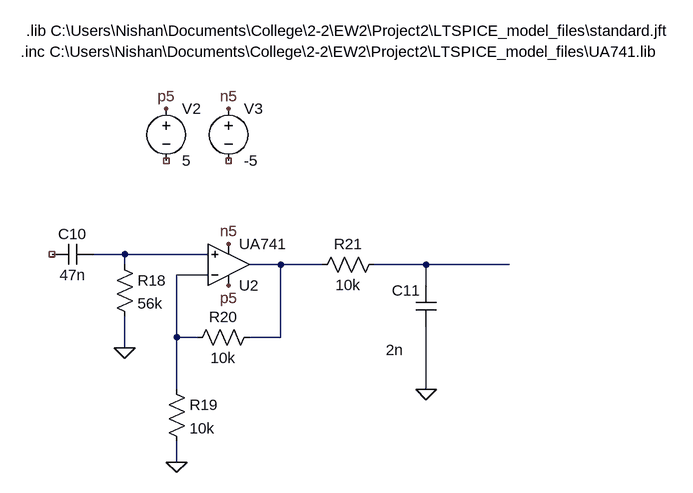
[diagram p0: schematic BPF.asc]
BPF.asc, the LTspice schematic file:
Version 4.1
SHEET 1 4496 2220
WIRE -48 384 -96 384
WIRE 80 384 -48 384
WIRE -48 400 -48 384
WIRE 192 400 144 400
WIRE 256 400 192 400
WIRE 416 400 336 400
WIRE 544 400 416 400
WIRE 80 416 32 416
WIRE 416 432 416 400
WIRE 32 512 32 416
WIRE 64 512 32 512
WIRE 192 512 192 400
WIRE 192 512 144 512
WIRE -48 528 -48 480
WIRE 32 592 32 512
WIRE 416 592 416 496
WIRE 32 704 32 672
FLAG 16 160 p5
FLAG 112 160 n5
FLAG -48 528 0
FLAG 112 368 n5
FLAG 112 432 p5
FLAG 32 704 0
FLAG 416 592 0
SYMBOL voltage 16 144 R0
WINDOW 123 0 0 Left 0
WINDOW 39 0 0 Left 0
SYMATTR InstName V2
SYMATTR Value 5
SYMBOL voltage 112 144 R0
WINDOW 123 0 0 Left 0
WINDOW 39 0 0 Left 0
SYMATTR InstName V3
SYMATTR Value -5
SYMBOL OpAmps\\opamp2 112 464 M180
SYMATTR InstName U2
SYMATTR Value UA741
SYMBOL cap -96 368 R90
WINDOW 0 0 32 VBottom 2
WINDOW 3 32 32 VTop 2
SYMATTR InstName C10
SYMATTR Value 47n
SYMBOL res -64 384 R0
SYMATTR InstName R18
SYMATTR Value 56k
SYMBOL res 16 576 R0
SYMATTR InstName R19
SYMATTR Value 10k
SYMBOL res 160 496 R90
WINDOW 0 0 56 VBottom 2
WINDOW 3 32 56 VTop 2
SYMATTR InstName R20
SYMATTR Value 10k
SYMBOL res 352 384 R90
WINDOW 0 0 56 VBottom 2
WINDOW 3 32 56 VTop 2
SYMATTR InstName R21
SYMATTR Value 10k
SYMBOL cap 432 496 R180
WINDOW 0 24 56 Left 2
WINDOW 3 51 -35 Left 2
SYMATTR InstName C11
SYMATTR Value 2n
TEXT -200 40 Left 2 !.lib C:\\Users\\Nishan\\Documents\\College\\2-2\\EW2\\Project2\\LTSPICE_model_files\\standard.jft
TEXT -208 72 Left 2 !.inc C:\\Users\\Nishan\\Documents\\College\\2-2\\EW2\\Project2\\LTSPICE_model_files\\UA741.lib

The netlist it stands for:
* BPF.asc
V2 p5 NC_01 5
V3 n5 NC_02 -5
X§U2 N001 N004 p5 n5 N002 UA741  ; pins In+ In- V+ V- OUT
C10 N001 NC_03 47n
R18 N001 0 56k
R19 N004 0 10k
R20 N002 N004 10k
R21 N003 N002 10k
C11 0 N003 2n
.lib C:\Users\Nishan\Documents\College\2-2\EW2\Project2\LTSPICE_model_files\standard.jft
.inc C:\Users\Nishan\Documents\College\2-2\EW2\Project2\LTSPICE_model_files\UA741.lib
.backanno
.end